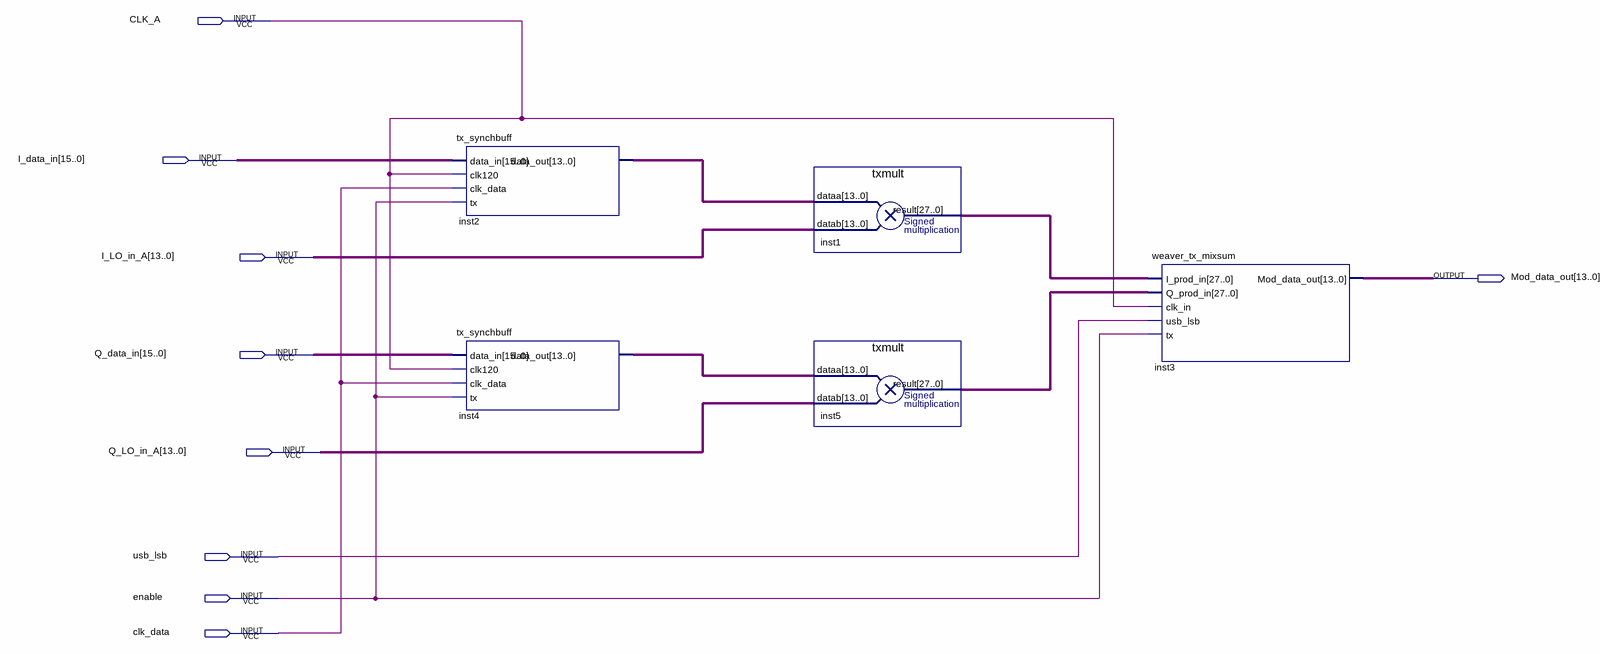
[diagram p0: schematic sheet]
// Quartus schematic tx_mod_blocks.bdf as structural Verilog: 5 symbols, 9 pins
module tx_mod_blocks (
  input  CLK_A,
  input  [15:0] I_data_in,
  input  [13:0] I_LO_in_A,
  input  [15:0] Q_data_in,
  input  [13:0] Q_LO_in_A,
  input  usb_lsb,
  input  enable,
  input  clk_data,
  output [13:0] Mod_data_out
);

  wire [13:0] inst2_data_out, inst4_data_out;
  wire [27:0] inst1_result, inst5_result;

  tx_synchbuff inst2 (.data_in(I_data_in), .clk120(CLK_A), .clk_data(clk_data), .tx(enable), .data_out(inst2_data_out));
  tx_synchbuff inst4 (.data_in(Q_data_in), .clk120(CLK_A), .clk_data(clk_data), .tx(enable), .data_out(inst4_data_out));
  txmult inst1 (.dataa(inst2_data_out), .datab(I_LO_in_A), .result(inst1_result));
  txmult inst5 (.dataa(inst4_data_out), .datab(Q_LO_in_A), .result(inst5_result));
  weaver_tx_mixsum inst3 (
    .I_prod_in(inst1_result), .Q_prod_in(inst5_result), .clk_in(CLK_A), .usb_lsb(usb_lsb), .tx(enable),
    .Mod_data_out(Mod_data_out));
endmodule
